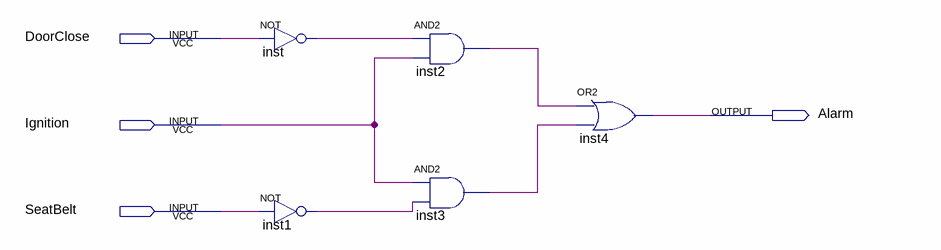
[diagram p0: schematic sheet]
// Quartus schematic Practice01.bdf as structural Verilog: 5 symbols, 4 pins
module Practice01 (
  input  DoorClose,
  input  Ignition,
  input  SeatBelt,
  output Alarm
);

  wire inst1_out, inst2_out, inst3_out, inst_out;

  not inst (inst_out, DoorClose);
  not inst1 (inst1_out, SeatBelt);
  and inst2 (inst2_out, inst_out, Ignition);
  and inst3 (inst3_out, Ignition, inst1_out);
  or inst4 (Alarm, inst2_out, inst3_out);
endmodule
